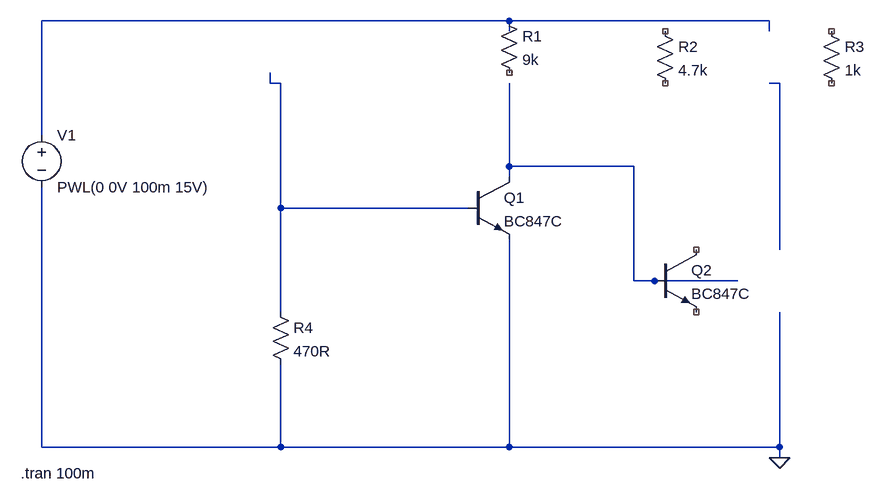
[diagram p0: schematic npn.asc]
npn.asc, the LTspice schematic file:
Version 4
SHEET 1 1208 680
WIRE 304 -224 -48 -224
WIRE 672 -224 304 -224
WIRE 1072 -224 672 -224
WIRE 672 -208 672 -224
WIRE 1072 -208 1072 -224
WIRE 304 -128 304 -144
WIRE 320 -128 304 -128
WIRE 1088 -128 1072 -128
WIRE -48 -48 -48 -224
WIRE 672 0 672 -128
WIRE 864 0 672 0
WIRE 672 16 672 0
WIRE 320 64 320 -128
WIRE 608 64 320 64
WIRE 1088 128 1088 -128
WIRE 864 176 864 0
WIRE 1024 176 864 176
WIRE 320 224 320 64
WIRE -48 432 -48 32
WIRE 320 432 320 304
WIRE 320 432 -48 432
WIRE 672 432 672 112
WIRE 672 432 320 432
WIRE 1088 432 1088 224
WIRE 1088 432 672 432
WIRE 1088 448 1088 432
FLAG 1088 448 0
SYMBOL voltage -48 -64 R0
WINDOW 123 0 0 Left 0
WINDOW 39 0 0 Left 0
SYMATTR InstName V1
SYMATTR Value PWL(0 0V 100m 15V)
SYMBOL res 656 -240 R0
SYMATTR InstName R1
SYMATTR Value 9k
SYMBOL res 896 -224 R0
SYMATTR InstName R2
SYMATTR Value 4.7k
SYMBOL res 1152 -224 R0
SYMATTR InstName R3
SYMATTR Value 1k
SYMBOL res 304 208 R0
SYMATTR InstName R4
SYMATTR Value 470R
SYMBOL npn 608 16 R0
SYMATTR InstName Q1
SYMATTR Value BC847C
SYMBOL npn 896 128 R0
SYMATTR InstName Q2
SYMATTR Value BC847C
TEXT -80 472 Left 2 !.tran 100m

The netlist it stands for:
* npn.asc
V1 N001 0 PWL(0 0V 100m 15V)
R1 N001 NC_01 9k
R2 NC_02 NC_03 4.7k
R3 NC_04 NC_05 1k
R4 N002 0 470R
Q1 N004 N002 0 0 BC847C
Q2 NC_06 N004 NC_07 0 BC847C
.model NPN NPN
.model PNP PNP
.lib standard.bjt
.tran 100m
.backanno
.end